# Altium project VCO.PrjPcb
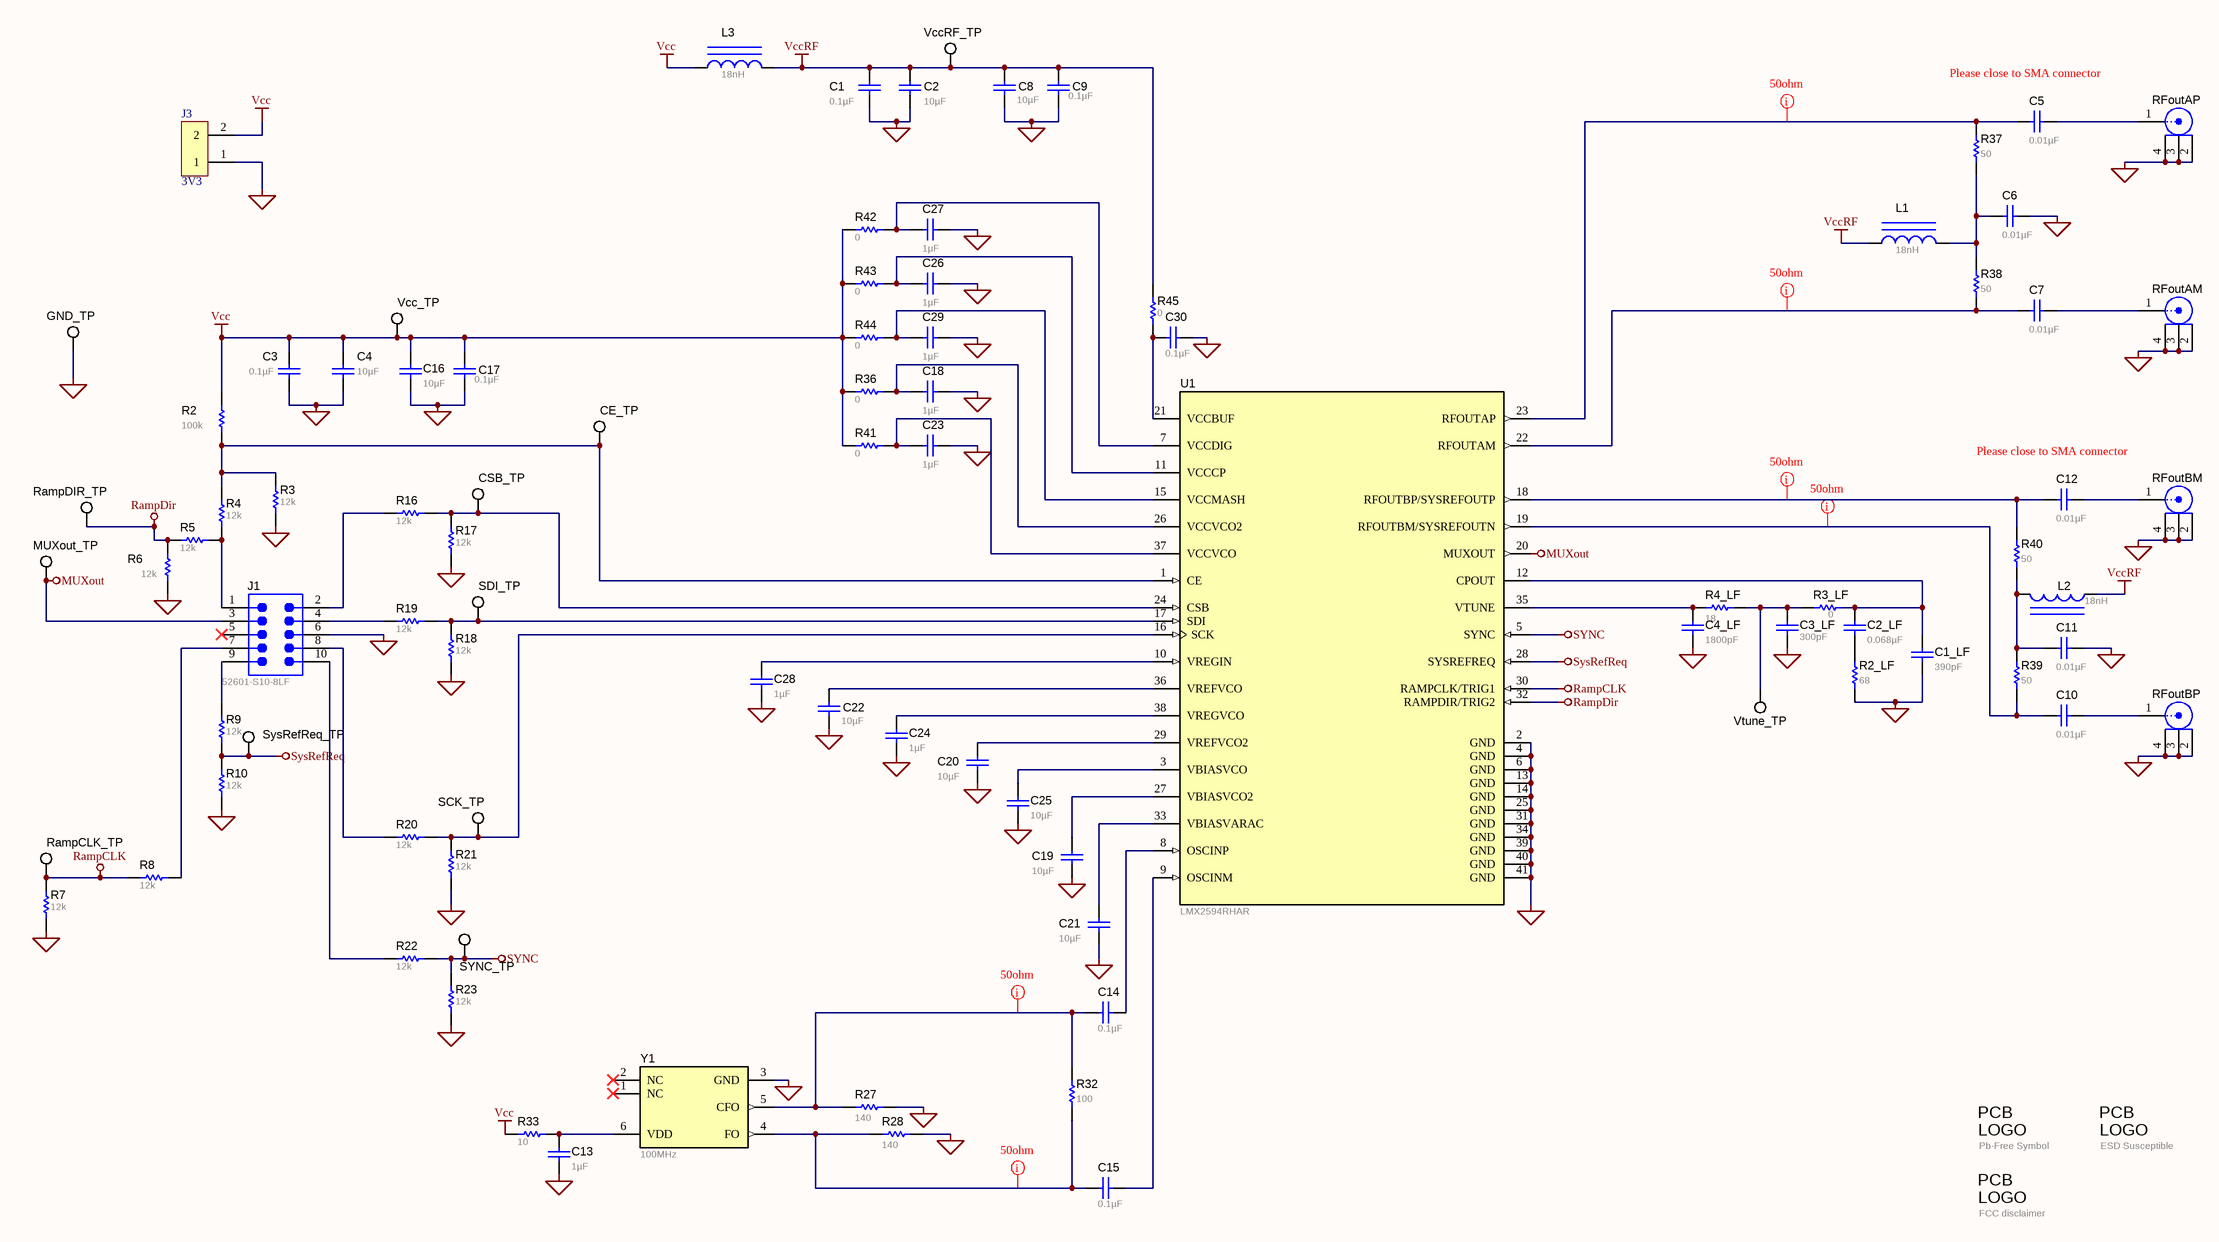
[diagram p0: VCO.SchDoc]
CopyrightYear: 2016; PCB_Layout: Dean Banerjee; PCB_Rev: B; PRJ_Customer: Public Release; PRJ_Engineer: Dean Banerjee; PRJ_Number: SV601308; PRJ_Title: LMX2594EVM; SCH_Rev: B; TechSupport: http://www.ti.com
2 sheets, 123 parts. Net scope: global (net labels, ports and power ports of the same name join across sheets).
Board file: VCO.PcbDoc
Sheets:
  VCO.SchDoc
  PVC.SchDoc

## Sheet VCO.SchDoc: LMX2594SOLDER
size C; Date: Not shown in title block; ApprovedBy: Not shown in title block; CheckedBy: Not shown in title block; Author: Not shown in title block; CompanyName: Not shown in title block; DrawnBy: Not shown in title block; Engineer: Not shown in title block; Organization: Not shown in title block; Address1: Not shown in title block; Address2: Not shown in title block; Address3: Not shown in title block; Address4: Not shown in title block; DocumentNumber: 1; Revision: Use project parameter SCH_Rev; SheetNumber: 1; SheetTotal: 1; PageSetup: Record=PageOptions|CenterHorizontal=True|CenterVertical=True|PrintScale=0.73|XCorrection=1.00|YCorrection=1.00|PrintKind=0|BorderSize=5000000|LeftOffset=0|BottomOffset=0|Orientation=2|PaperLength=1000|PaperWidth=1000|Scale=100|PaperSource=15|PrintQuality=600|MediaType=1|DitherType=10|PrintScaleMode=1|PaperKind=Legal (8.5 x 14")|PaperIndex=5; CurrentTime: Not shown in title block; CurrentDate: Not shown in title block; Time: Not shown in title block; DocumentFullPathAndName: Not shown in title block; DocumentName: Not shown in title block; ModifiedDate: 2/1/2011; ImagePath: Not shown in title block; ProjectName: LMX2594EVM

### Parts
C1  ValueDisplayed: 0.1µF  [0603]  (hidden comment: 0603YC104JAT2A)
C1_LF  ValueDisplayed: 390pF  [0603]  (hidden comment: C0603C391J5GACTU)
C2  ValueDisplayed: 10µF  [0805]  (hidden comment: C0805C106K8PACTU)
C2_LF  ValueDisplayed: 0.068µF  [0603]  (hidden comment: GRM188R71H683KA93D)
C3  ValueDisplayed: 0.1µF  [0603]  (hidden comment: 0603YC104JAT2A)
C3_LF  ValueDisplayed: 300pF  [0603]  (hidden comment: GRM1885C2A301JA01D)
C4  ValueDisplayed: 10µF  [0805]  (hidden comment: C0805C106K8PACTU)
C4_LF  ValueDisplayed: 1800pF  [0603]  (hidden comment: GRM1885C1H182JA01D)
C5  ValueDisplayed: 0.01µF  [0402_065]  (hidden comment: 520L103KT16T)
C6  ValueDisplayed: 0.01µF  [0402_065]  (hidden comment: 520L103KT16T)
C7  ValueDisplayed: 0.01µF  [0402_065]  (hidden comment: 520L103KT16T)
C8  ValueDisplayed: 10µF  [0805]  (hidden comment: C0805C106K8PACTU)
C9  ValueDisplayed: 0.1µF  [0603]  (hidden comment: 0603YC104JAT2A)
C10  ValueDisplayed: 0.01µF  [0402_065]  (hidden comment: 520L103KT16T)
C11  ValueDisplayed: 0.01µF  [0402_065]  (hidden comment: 520L103KT16T)
C12  ValueDisplayed: 0.01µF  [0402_065]  (hidden comment: 520L103KT16T)
C13  ValueDisplayed: 1µF  [0603]  (hidden comment: C1608X7R1C105K080AC)
C14  ValueDisplayed: 0.1µF  [0603L]  (hidden comment: 0603YC104JAT2A)
C15  ValueDisplayed: 0.1µF  [0603L]  (hidden comment: 0603YC104JAT2A)
C16  ValueDisplayed: 10µF  [0805]  (hidden comment: C0805C106K8PACTU)
C17  ValueDisplayed: 0.1µF  [0603]  (hidden comment: 0603YC104JAT2A)
C18  ValueDisplayed: 1µF  [0603]  (hidden comment: C1608X7R1C105K080AC)
C19  ValueDisplayed: 10µF  [0603]  (hidden comment: C1608X5R1A106M080AC)
C20  ValueDisplayed: 10µF  [0603]  (hidden comment: C1608X5R1A106M080AC)
C21  ValueDisplayed: 10µF  [0603]  (hidden comment: C1608X5R1A106M080AC)
C22  ValueDisplayed: 10µF  [0603]  (hidden comment: C1608X5R1A106M080AC)
C23  ValueDisplayed: 1µF  [0603]  (hidden comment: C1608X7R1C105K080AC)
C24  ValueDisplayed: 1µF  [0603]  (hidden comment: C1608X7R1C105K080AC)
C25  ValueDisplayed: 10µF  [0603]  (hidden comment: C1608X5R1A106M080AC)
C26  ValueDisplayed: 1µF  [0603L]  (hidden comment: C1608X7R1C105K080AC)
C27  ValueDisplayed: 1µF  [0603]  (hidden comment: C1608X7R1C105K080AC)
C28  ValueDisplayed: 1µF  [0603]  (hidden comment: C1608X7R1C105K080AC)
C29  ValueDisplayed: 1µF  [0603L]  (hidden comment: C1608X7R1C105K080AC)
C30  ValueDisplayed: 0.1µF  [0603L]  (hidden comment: 0603YC104JAT2A)
CE_TP  5007  [Keystone5007]  (value not drawn)
CSB_TP  5007  [Keystone5007]  (value not drawn)
GND_TP  5007  [Keystone5007]  (value not drawn)
J1  52601-S10-8LF  [FCI_52601-S10-8LF]
J3  3V3  [PHOENIX_1935161]
L1  ValueDisplayed: 18nH  [IND_LQG15H]  (hidden comment: LQG15HS18NJ02D)
L2  ValueDisplayed: 18nH  [IND_LQG15H]  (hidden comment: LQG15HS18NJ02D)
L3  ValueDisplayed: 18nH  [0402L]  (hidden comment: LQG15HS18NJ02D)
Logo1  ESD Susceptible  [ESD_Overlay_Small]  (no BOM)
Logo3  Pb-Free Symbol  [Pb-Free_Overlay_Medium]  (no BOM)
Logo4  FCC disclaimer  [FCC_disclaimer]  (no BOM)
MUXout_TP  5007  [Keystone5007]  (value not drawn)
R2  ValueDisplayed: 100k  [0603]  (hidden comment: CRCW0603100KJNEA)
R2_LF  ValueDisplayed: 68  [0603]  (hidden comment: CRCW060368R0JNEA)
R3  value 12k  [0603]  (hidden comment: CRCW060312K0JNEA)
R3_LF  ValueDisplayed: 0  [0603]  (hidden comment: CRCW06030000Z0EA)
R4  value 12k  [0603]  (hidden comment: CRCW060312K0JNEA)
R4_LF  ValueDisplayed: 18  [0603]  (hidden comment: CRCW060318R0JNEA)
R5  value 12k  [0603]  (hidden comment: CRCW060312K0JNEA)
R6  value 12k  [0603]  (hidden comment: CRCW060312K0JNEA)
R7  value 12k  [0603]  (hidden comment: CRCW060312K0JNEA)
R8  value 12k  [0603]  (hidden comment: CRCW060312K0JNEA)
R9  value 12k  [0603]  (hidden comment: CRCW060312K0JNEA)
R10  value 12k  [0603]  (hidden comment: CRCW060312K0JNEA)
R16  value 12k  [0603]  (hidden comment: CRCW060312K0JNEA)
R17  value 12k  [0603]  (hidden comment: CRCW060312K0JNEA)
R18  value 12k  [0603]  (hidden comment: CRCW060312K0JNEA)
R19  value 12k  [0603]  (hidden comment: CRCW060312K0JNEA)
R20  value 12k  [0603]  (hidden comment: CRCW060312K0JNEA)
R21  value 12k  [0603]  (hidden comment: CRCW060312K0JNEA)
R22  value 12k  [0603]  (hidden comment: CRCW060312K0JNEA)
R23  value 12k  [0603]  (hidden comment: CRCW060312K0JNEA)
R27  ValueDisplayed: 140  [0603]  (hidden comment: CRCW0603140RFKEA)
R28  ValueDisplayed: 140  [0603]  (hidden comment: CRCW0603140RFKEA)
R32  ValueDisplayed: 100  [0603L]  (hidden comment: CRCW0603100RFKEA)
R33  value 10  [0603]  (hidden comment: CRCW060310R0JNEA)
R36  value 0  [0603]  (hidden comment: CRCW06030000Z0EA)
R37  ValueDisplayed: 50  [0402L]  (hidden comment: FC0402E50R0BST1)
R38  ValueDisplayed: 50  [0402L]  (hidden comment: FC0402E50R0BST1)
R39  ValueDisplayed: 50  [0402L]  (hidden comment: FC0402E50R0BST1)
R40  ValueDisplayed: 50  [0402L]  (hidden comment: FC0402E50R0BST1)
R41  value 0  [0603]  (hidden comment: CRCW06030000Z0EA)
R42  value 0  [0603]  (hidden comment: CRCW06030000Z0EA)
R43  value 0  [0603L]  (hidden comment: CRCW06030000Z0EA)
R44  value 0  [0603L]  (hidden comment: CRCW06030000Z0EA)
R45  value 0  [0603L]  (hidden comment: CRCW06030000Z0EA)
RampCLK_TP  5007  [Keystone5007]  (value not drawn)
RampDIR_TP  5007  [Keystone5007]  (value not drawn)
RFoutAM  142-0771-831  [Johnson_142-0771-831]  (value not drawn)
RFoutAP  142-0771-831  [Johnson_142-0771-831]  (value not drawn)
RFoutBM  142-0771-831  [Johnson_142-0771-831]  (value not drawn)
RFoutBP  142-0771-831  [Johnson_142-0771-831]  (value not drawn)
SCK_TP  5007  [Keystone5007]  (value not drawn)
SDI_TP  5007  [Keystone5007]  (value not drawn)
SYNC_TP  5007  [Keystone5007]  (value not drawn)
SysRefReq_TP  5007  [Keystone5007]  (value not drawn)
U1  LMX2594RHAR  [RHA0040A]
Vcc_TP  5007  [Keystone5007]  (value not drawn)
VccRF_TP  5007  [Keystone5007]  (value not drawn)
Vtune_TP  5007  [Keystone5007]  (value not drawn)
Y1  Frequency: 100MHz  [Vectron_VC-708]  (hidden comment: VC-708-EDE-FNXN-100M000000)

### Nets
GND: C1.1 C1_LF.2 C2.1 C3.1 C3_LF.2 C4.1 C4_LF.1 C6.1 C8.1 C9.1 C11.1 C13.2 C16.1 C17.1 C18.1 C19.1 C20.2 C21.1 C22.2 C23.1 C24.1 C25.2 C26.1 C27.1 C28.1 C29.2 C30.1 GND_TP.1 J1.6 J3.1 R2_LF.2 R3.1 R6.1 R7.1 R10.1 R17.1 R18.1 R21.1 R23.1 R27.1 R28.1 RFoutAM.2 RFoutAM.3 RFoutAM.4 RFoutAP.2 RFoutAP.3 RFoutAP.4 RFoutBM.2 RFoutBM.3 RFoutBM.4 RFoutBP.2 RFoutBP.3 RFoutBP.4 U1.2(GND) U1.4(GND) U1.6(GND) U1.13(GND) U1.14(GND) U1.25(GND) U1.31(GND) U1.34(GND) U1.39(GND) U1.40(GND) U1.41(GND) Y1.3(GND)
MUXout: J1.3 MUXout_TP.1 U1.20(MUXOUT)
RampCLK: R7.2 R8.2 RampCLK_TP.1 U1.30(RAMPCLK/TRIG1)
RampDir: R5.1 R6.2 RampDIR_TP.1 U1.32(RAMPDIR/TRIG2)
SYNC: R22.2 R23.2 SYNC_TP.1 U1.5(SYNC)
SysRefReq: R9.2 R10.2 SysRefReq_TP.1 U1.28(SYSREFREQ)
Vcc: C3.2 C4.2 C16.2 C17.2 J3.2 L3.1 R2.1 R33.2 R36.2 R41.2 R42.1 R43.1 R44.1 Vcc_TP.1
VccRF: C1.2 C2.2 C8.2 C9.2 L1.1 L2.1 L3.2 R45.1 VccRF_TP.1
NetC1_LF_1: C1_LF.1 C2_LF.1 R3_LF.1 U1.12(CPOUT)
NetC2_LF_2: C2_LF.2 R2_LF.1
NetC3_LF_1: C3_LF.1 R3_LF.2 R4_LF.2 Vtune_TP.1
NetC4_LF_2: C4_LF.2 R4_LF.1 U1.35(VTUNE)
NetC5_1: C5.1 RFoutAP.1
NetC5_2: C5.2 R37.1 U1.23(RFOUTAP)
NetC6_2: C6.2 L1.2 R37.2 R38.2
NetC7_1: C7.1 RFoutAM.1
NetC7_2: C7.2 R38.1 U1.22(RFOUTAM)
NetC10_1: C10.1 RFoutBP.1
NetC10_2: C10.2 R39.1 U1.19(RFOUTBM/SYSREFOUTN)
NetC11_2: C11.2 L2.2 R39.2 R40.1
NetC12_1: C12.1 RFoutBM.1
NetC12_2: C12.2 R40.2 U1.18(RFOUTBP/SYSREFOUTP)
NetC13_1: C13.1 R33.1 Y1.6(VDD)
NetC14_1: C14.1 R27.2 R32.2 Y1.5(CFO)
NetC14_2: C14.2 U1.8(OSCINP)
NetC15_1: C15.1 R28.2 R32.1 Y1.4(FO)
NetC15_2: C15.2 U1.9(OSCINM)
NetC18_2: C18.2 R36.1 U1.26(VCCVCO2)
NetC19_2: C19.2 U1.27(VBIASVCO2)
NetC20_1: C20.1 U1.29(VREFVCO2)
NetC21_2: C21.2 U1.33(VBIASVARAC)
NetC22_1: C22.1 U1.36(VREFVCO)
NetC23_2: C23.2 R41.1 U1.37(VCCVCO)
NetC24_2: C24.2 U1.38(VREGVCO)
NetC25_1: C25.1 U1.3(VBIASVCO)
NetC26_2: C26.2 R43.2 U1.11(VCCCP)
NetC27_2: C27.2 R42.2 U1.7(VCCDIG)
NetC28_2: C28.2 U1.10(VREGIN)
NetC29_1: C29.1 R44.2 U1.15(VCCMASH)
NetC30_2: C30.2 R45.2 U1.21(VCCBUF)
NetCE_TP_1: CE_TP.1 R2.2 R3.2 R4.2 U1.1(CE)
NetCSB_TP_1: CSB_TP.1 R16.2 R17.2 U1.24(CSB)
NetJ1_1: J1.1 R4.1 R5.2
NetJ1_2: J1.2 R16.1
NetJ1_4: J1.4 R19.2
NetJ1_7: J1.7 R8.1
NetJ1_8: J1.8 R20.1
NetJ1_9: J1.9 R9.1
NetJ1_10: J1.10 R22.1
NetR18_2: R18.2 R19.1 SDI_TP.1 U1.17(SDI)
NetR20_2: R20.2 R21.2 SCK_TP.1 U1.16(SCK)

Not connected (* = marked no-connect by the designer): J1 5*; Y1 1(NC)* 2(NC)*

### Layout directives
mark named 50ohm: NetC5_2, NetC7_2, NetC10_2, NetC12_2, NetC14_1, NetC15_1

### Notes on the sheet
- Please close to SMA connector
- Title
- Size:
- Date:
- File:
- C
- Number:
- Time:
- Revision:
- Sheet
- of
- (in symbol ESD_Susceptible) PCB; LOGO
- (in symbol FCC_disclaimer) PCB; LOGO
- (in symbol Pb-Free) PCB; LOGO

### Library data of the parts
C1 C3 C9 C17 = 0603YC104JAT2A: CAP, CERM, 0.1uF, 16V, +/-5%, X7R, 0603; Manufacturer: AVX; ESR_Ohm: 0.039; Polarized: N; TaMax_C: 125; TaMin_C: -55; Tolerance_%: 5; VDC_V: 16; Cap_F: 0.0000001; CompType: Capacitor; Value1: 0.039 ohm; U/M: EA; Cap_Case: 0603; MountType: SMT; Technology: Ceramic; PartNumber: 0603YC104JAT2A; SymbolVersion: 2008-07-09; RoHS: Y; Dielectric: X7R; Value: 0.1uF; DigiKeyPartNumber: 478-3726-1-ND; PackageReference: 0603; Value2: 16V; Published: 2008-06-19; Publisher: National Semiconductor; LatestRevisionDate: 2011-06-13; LatestRevisionNote: Added Alternate PartNumber and Alternate Manufacturer parameters.; ComponentLink1Description: Datasheet link; ComponentLink1URL: http://www.avx.com/docs/masterpubs/smccp.pdf; Alternate PartNumber: -; Alternate Manufacturer: -
C1_LF = C0603C391J5GACTU: CAP, CERM, 390 pF, 50 V, +/- 5%, C0G/NP0, 0603; Manufacturer: Kemet; Polarized: N; TaMax_C: 125; TaMin_C: -55; Tolerance_%: 5; VDC_V: 50; Cap_F: 0.00000000039; CompType: Capacitor; Value: 390pF; Value1: Unknown; Value2: 50V; U/M: EA; AEC Category: Q200; SizeArea_mm2: 1.28; SizeAreaWB_mm2: 4.68; SizeX_mm: 1.6; SizeY_mm: 0.8; SizeZ_mm: 1; Cap_Case: 0603; MountType: SMT; Technology: Ceramic; PartNumber: C0603C391J5GACTU; SymbolVersion: 2008-07-09; RoHS: Y; PackageReference: 0603; Published: 2008-06-19; Publisher: Texas Instruments; LatestRevisionDate: 2016-11-28; ComponentLink1Description: Datasheet link; ComponentLink1URL: http://www.kemet.com/kemet/web/homepage/kechome.nsf/vapubfiles/F3102_Y5V.pdf/$file/F3102_Y5V.pdf; TempCo: C0G/NP0; Supplier 1: Digi-Key; Supplier Part Number 1: 399-1069-1-ND; Supplier 2: Mouser; Supplier Part Number 2: 80-C0603C391J5G; Supplier 3: Farnell; Supplier Part Number 3: 1414638; AEC Qualified: ?
C2 C4 C8 C16 = C0805C106K8PACTU: CAP, CERM, 10uF, 10V, +/-10%, X5R, 0805; Manufacturer: Kemet; ESR_Ohm: 0.003; IRMS_A: 11.43; Polarized: N; TaMax_C: 85; TaMin_C: -55; Tolerance_%: 10; Cap_F: 0.00001; CompType: Capacitor; U/M: EA; Value1: 0.003 ohm; Cap_Case: 0805; MountType: SMT; Technology: Ceramic; VDC_V: 10; PartNumber: C0805C106K8PACTU; SymbolVersion: 2008-07-09; RoHS: Y; Dielectric: X5R; Value: 10uF; DigiKeyPartNumber: 399-4925-1-ND; PackageReference: 0805; Value2: 10V; Published: 2008-06-19; Publisher: National Semiconductor; LatestRevisionDate: 2011-03-11; LatestRevisionNote: Added Alternate PartNumber and Alternate Manufacturer parameters.; ComponentLink1Description: Datasheet link; ComponentLink1URL: http://www.kemet.com/kemet/web/homepage/kechome.nsf/file/Partial%20Copy%20-%20Ceramic%20Surface%20Mount%20Capacitors/$file/F3102_CE.pdf; Supplier 1: Newark; Supplier Part Number 1: 70K9138; Alternate PartNumber: -; Alternate Manufacturer: -
C2_LF = GRM188R71H683KA93D: CAP, CERM, 0.068 µF, 50 V, +/- 10%, X7R, 0603; Manufacturer: MuRata; Polarized: N; TaMax_C: 125; TaMin_C: -55; Tolerance_%: 10; VDC_V: 50; Cap_F: 0.000000068; CompType: Capacitor; Value: 0.068uF; Value1: Unknown; Value2: 50V; U/M: EA; AEC Category: Q200; SizeArea_mm2: 1.28; SizeAreaWB_mm2: 4.68; SizeX_mm: 1.6; SizeY_mm: 0.8; SizeZ_mm: 1; Cap_Case: 0603; MountType: SMT; Technology: Ceramic; PartNumber: GRM188R71H683KA93D; SymbolVersion: 2008-07-09; RoHS: Y; PackageReference: 0603; Published: 2008-06-19; Publisher: Texas Instruments; LatestRevisionDate: 2016-11-28; ComponentLink1Description: Datasheet link; ComponentLink1URL: http://search.murata.co.jp/Ceramy/PnsearchViewAction.do?HnOFG=ON&HnNFG=ON&SEL_CNT=50&sLang=en&sKey=GRM188R71H683KA93D&x=9&y=9&search=startwith; TempCo: X7R; Supplier 1: Digi-Key; Supplier Part Number 1: 490-3288-1-ND; Supplier 2: Mouser; Supplier Part Number 2: 81-GRM188R71H683KA93; Supplier 3: Farnell; Supplier Part Number 3: 1403793; AEC Qualified: ?
C3_LF = GRM1885C2A301JA01D: CAP, CERM, 300pF, 100V, +/-5%, C0G/NP0, 0603; Manufacturer: MuRata; Polarized: N; TaMax_C: 125; TaMin_C: -55; Tolerance_%: 5; VDC_V: 100; Cap_F: 0.0000000003; CompType: Capacitor; Value1: Unknown; U/M: EA; Cap_Case: 0603; MountType: SMT; Technology: Ceramic; PartNumber: GRM1885C2A301JA01D; SymbolVersion: 2008-07-09; RoHS: Y; Value: 300pF; PackageReference: 0603; Value2: 100V; Published: 2008-06-19; Publisher: Texas Instruments; LatestRevisionDate: 2014-03-28; ComponentLink1Description: Datasheet link; ComponentLink1URL: http://search.murata.co.jp/Ceramy/PnsearchViewAction.do?HnOFG=ON&HnNFG=ON&SEL_CNT=50&sLang=en&sKey=GRM1885C2A301JA01D&x=9&y=9&search=startwith; TempCo: C0G/NP0; Supplier 1: Digi-Key; Supplier Part Number 1: 490-1362-1-ND; Supplier 2: Mouser; Supplier Part Number 2: 81-GRM1885C2A301JA1D
C4_LF = GRM1885C1H182JA01D: CAP, CERM, 1800 pF, 50 V, +/- 5%, C0G/NP0, 0603; Manufacturer: MuRata; Polarized: N; TaMax_C: 125; TaMin_C: -55; Tolerance_%: 5; VDC_V: 50; Cap_F: 0.0000000018; CompType: Capacitor; Value: 1800pF; Value1: Unknown; Value2: 50V; U/M: EA; SizeArea_mm2: 1.28; SizeAreaWB_mm2: 4.68; SizeX_mm: 1.6; SizeY_mm: 0.8; SizeZ_mm: 1; AEC Category: Q200; Cap_Case: 0603; MountType: SMT; Technology: Ceramic; PartNumber: GRM1885C1H182JA01D; SymbolVersion: 2008-07-09; RoHS: Y; PackageReference: 0603; Published: 2008-06-19; Publisher: Texas Instruments; LatestRevisionDate: 2016-11-28; ComponentLink1Description: Datasheet link; ComponentLink1URL: http://search.murata.co.jp/Ceramy/PnsearchViewAction.do?HnOFG=ON&HnNFG=ON&SEL_CNT=50&sLang=en&sKey=GRM1885C1H182JA01D&x=9&y=9&search=startwith; TempCo: C0G/NP0; Supplier 1: Digi-Key; Supplier Part Number 1: 490-1457-1-ND; Supplier 2: Mouser; Supplier Part Number 2: 81-GRM1885C1H182JA01; AEC Qualified: ?
C5-C7 C10-C12 = 520L103KT16T: CAP, CERM, 0.01 µF, 16 V, +/- 10%, X7R, 0402; Manufacturer: AT Ceramics; Polarized: N; CompType: Capacitor; Value: 0.01uF; U/M: EA; Cap_F: 0.00000001; Tolerance_%: 10; Value1: Unknown; VDC_V: 16; Value2: 16V; TaMin_C: -55; TaMax_C: 125; Cap_Case: 0402; AEC Category: Q200; SizeArea_mm2: 0.5; SizeAreaWB_mm2: 3; SizeX_mm: 1; SizeZ_mm: 0.65; SymbolVersion: 2008-07-09; PartNumber: 520L103KT16T; PackageReference: 0402; RoHS: Y; MountType: SMT; Technology: Ceramic; TempCo: X7R; Published: 2008-06-19; Publisher: Texas Instruments; LatestRevisionDate: 2016-06-23; ComponentLink1Description: Datasheet link; ComponentLink1URL: https://www.atceramics.com/UserFiles/520l.pdf; Supplier 1: Digi-Key; Supplier Part Number 1: 1284-1540-1-ND; Supplier 2: Mouser; Supplier Part Number 2: 581-520L103KT16T; AEC Qualified: N; AEC Grade: N/A; SizeY_mm: 0.5
C13 C24 = C1608X7R1C105K080AC: CAP, CERM, 1 µF, 16 V, +/- 10%, X7R, 0603; Manufacturer: TDK; ESR_ohm: 0.0057; Polarized: N; TaMax_C: 125; TaMin_C: -55; Tolerance_%: 10; VDC_V: 16; Cap_F: 0.000001; CompType: Capacitor; Value: 1uF; U/M: EA; Value1: 0.0057 ohm; Value2: 16V; AEC Category: Q200; Cap_Case: 0603; MountType: SMT; Technology: Ceramic; PartNumber: C1608X7R1C105K080AC; SymbolVersion: 2008-07-09; RoHS: Y; PackageReference: 0603; ComponentLink1Description: Datasheet link; ComponentLink1URL: http://www.tdk.co.jp/tefe02/e412_c.pdf; Publisher: Texas Instruments; LatestRevisionDate: 2016-03-08; Published: 2008-06-19; TempCo: X7R; Supplier 1: Digi-Key; Supplier Part Number 1: 445-1604-1-ND; Supplier 2: Mouser; Supplier Part Number 2: 810-C1608X7R1C105K; Supplier 3: Farnell; Supplier Part Number 3: 1907343; AEC Qualified: ?
C14 C15 C30 = 0603YC104JAT2A: CAP, CERM, 0.1uF, 16V, +/-5%, X7R, 0603; Manufacturer: AVX; Cap_Case: 0603; ESR_Ohm: 0.039; Polarized: N; TaMax_C: 125; TaMin_C: -55; Tolerance_%: 5; VDC_V: 16; Cap_F: 0.0000001; CompType: Capacitor; Value1: 0.039 ohm; U/M: EA; MountType: SMT; Technology: Ceramic; PartNumber: 0603YC104JAT2A; SymbolVersion: 2008-07-09; RoHS: Y; Dielectric: X7R; Value: 0.1uF; DigiKeyPartNumber: 478-3726-1-ND; PackageReference: 0603; Value2: 16V; Published: 2008-06-19; Publisher: National Semiconductor; LatestRevisionDate: 2011-06-13; LatestRevisionNote: Added Alternate PartNumber and Alternate Manufacturer parameters.; ComponentLink1Description: Datasheet link; ComponentLink1URL: http://www.avx.com/docs/masterpubs/smccp.pdf; Alternate PartNumber: -; Alternate Manufacturer: -
C18 C23 C27 = C1608X7R1C105K080AC: CAP, CERM, 1 µF, 16 V, +/- 10%, X7R, 0603; Manufacturer: TDK; ESR_ohm: 0.0057; Polarized: N; TaMax_C: 125; TaMin_C: -55; Tolerance_%: 10; VDC_V: 16; Cap_F: 0.000001; CompType: Capacitor; Value: 1uF; Value1: 0.0057 ohm; Value2: 16V; U/M: EA; SizeArea_mm2: 1.28; SizeAreaWB_mm2: 4.68; SizeX_mm: 1.6; SizeY_mm: 0.8; SizeZ_mm: 1; AEC Category: Q200; Cap_Case: 0603; MountType: SMT; Technology: Ceramic; PartNumber: C1608X7R1C105K080AC; SymbolVersion: 2008-07-09; RoHS: Y; PackageReference: 0603; Published: 2008-06-19; Publisher: Texas Instruments; LatestRevisionDate: 2016-06-30; ComponentLink1Description: Datasheet link; ComponentLink1URL: http://www.tdk.co.jp/tefe02/e412_c.pdf; TempCo: X7R; Supplier 1: Digi-Key; Supplier Part Number 1: 445-1604-1-ND; Supplier 2: Mouser; Supplier Part Number 2: 810-C1608X7R1C105K; Supplier 3: Farnell; Supplier Part Number 3: 1907343; AEC Qualified: ?
C19-C22 C25 = C1608X5R1A106M080AC: CAP, CERM, 10 µF, 10 V, +/- 20%, X5R, 0603; Manufacturer: TDK; ESR_ohm: 0.0078; IRMS_A: 1.85; Polarized: N; TaMax_C: 85; TaMin_C: -55; Tolerance_%: 20; VDC_V: 10; Cap_F: 0.00001; CompType: Capacitor; Value: 10uF; U/M: EA; Value1: 0.0078 ohm; Value2: 10V; AEC Category: Q200; Cap_Case: 0603; MountType: SMT; Technology: Ceramic; PartNumber: C1608X5R1A106M080AC; SymbolVersion: 2008-07-09; RoHS: Y; PackageReference: 0603; Published: 2008-06-19; Publisher: Texas Instruments; LatestRevisionDate: 2016-03-08; ComponentLink1Description: Datasheet link; ComponentLink1URL: http://www.tdk.com/pdf/general_B11.pdf; TempCo: X5R; Supplier 1: Digi-Key; Supplier Part Number 1: 445-6853-1-ND; Supplier 2: Mouser; Supplier Part Number 2: 810-C1608X5R1A106M; Supplier 3: Farnell; Supplier Part Number 3: 1962113; AEC Qualified: ?
C26 C29 = C1608X7R1C105K080AC: CAP, CERM, 1 µF, 16 V, +/- 10%, X7R, 0603; Manufacturer: TDK; Cap_Case: 0603; ESR_ohm: 0.0057; Polarized: N; TaMax_C: 125; TaMin_C: -55; Tolerance_%: 10; VDC_V: 16; Cap_F: 0.000001; CompType: Capacitor; Value: 1uF; Value1: 0.0057 ohm; Value2: 16V; U/M: EA; SizeArea_mm2: 1.28; SizeAreaWB_mm2: 4.68; SizeX_mm: 1.6; SizeY_mm: 0.8; SizeZ_mm: 1; AEC Category: Q200; MountType: SMT; Technology: Ceramic; PartNumber: C1608X7R1C105K080AC; SymbolVersion: 2008-07-09; RoHS: Y; PackageReference: 0603; Published: 2008-06-19; Publisher: Texas Instruments; LatestRevisionDate: 2016-06-30; ComponentLink1Description: Datasheet link; ComponentLink1URL: http://www.tdk.co.jp/tefe02/e412_c.pdf; TempCo: X7R; Supplier 1: Digi-Key; Supplier Part Number 1: 445-1604-1-ND; Supplier 2: Mouser; Supplier Part Number 2: 810-C1608X7R1C105K; Supplier 3: Farnell; Supplier Part Number 3: 1907343; AEC Qualified: ?
C28 = C1608X7R1C105K080AC: CAP, CERM, 1 µF, 16 V, +/- 10%, X7R, 0603; Manufacturer: TDK; Polarized: N; CompType: Capacitor; Value: 1uF; U/M: EA; Cap_F: 0.000001; Tolerance_%: 10; ESR_ohm: 0.0057; Value1: 0.0057 ohm; VDC_V: 16; Value2: 16V; TaMin_C: -55; TaMax_C: 125; AEC Category: Q200; SymbolVersion: 2008-07-09; PartNumber: C1608X7R1C105K080AC; PackageReference: 0603; RoHS: Y; MountType: SMT; Technology: Ceramic; TempCo: X7R; Cap_Case: 0603; Published: 2008-06-19; Publisher: Texas Instruments; LatestRevisionDate: 2016-03-08; ComponentLink1Description: Datasheet link; ComponentLink1URL: http://www.tdk.co.jp/tefe02/e412_c.pdf; Supplier 1: Digi-Key; Supplier Part Number 1: 445-1604-1-ND; Supplier 2: Mouser; Supplier Part Number 2: 810-C1608X7R1C105K; Supplier 3: Farnell; Supplier Part Number 3: 1907343; AEC Qualified: ?
CE_TP CSB_TP GND_TP MUXout_TP RampCLK_TP RampDIR_TP SCK_TP SDI_TP SYNC_TP SysRefReq_TP Vcc_TP VccRF_TP Vtune_TP = 5007: Test Point, Compact, White, TH; Manufacturer: Keystone; CompType: Test Point Loop; U/M: EA; SymbolVersion: 2008-04-04; PartNumber: 5007; Value: White; RoHS: Y; PackageReference: White Compact Testpoint; MountType: TH; ComponentLink1Description: Datasheet Link; ComponentLink1URL: http://www.keyelco.com/userAssets/file/M60-2p60.pdf; Publisher: Texas Instruments; LatestRevisionDate: 2013-07-19; Supplier 1: Digi-Key; Supplier Part Number 1: 5007K-ND
J1 = 52601-S10-8LF: Header (shrouded), 100mil, 5x2, Gold plated, SMD; Manufacturer: FCI; SymbolCreator: a0412235; U/M: EA; CompType: Header; PartNumber: 52601-S10-8LF; SymbolVersion: 2013-03-14; ClassName: Header; RoHS: Y; PackageReference: SMT Header; MountType: SMT; ComponentLink1Description: Datasheet Link; ComponentLink1URL: http://portal.fciconnect.com/Comergent//fci/drawing/52601.pdf; Publisher: Texas Instruments; LatestRevisionDate: 2013-07-19; Supplier 1: Digi-Key; Supplier Part Number 1: 609-3593-ND; Supplier 2: Mouser; Supplier Part Number 2: 649-52601-S10-8LF
J3 = 1935161: 2 Position Wire to Board Terminal Block Horizontal with Board 0.197 _5.00mm_ Through Hole; MF: Phoenix Contact; SnapEDA_Link: https://www.snapeda.com/parts/1935161/Phoenix%20Contact/view-part/423515/?ref=snap; MP: 1935161; Value: *; Digi-Key_Purchase_URL: https://www.digikey.ca/product-detail/en/phoenix-contact/1935161/277-1667-ND/568614?utm_source=snapeda&utm_medium=aggregator&utm_campaign=symbol; Digi-Key_Part_Number: 277-1667-ND; Package: None
L1-L3 = LQG15HS18NJ02D: Inductor, Multilayer, Air Core, 18 nH, 0.3 A, 0.36 ohm, SMD; Manufacturer: MuRata; Value: 18nH; Ind_H: 18.0E-9; Imax_A: 0.3; Irms: 0.3A @ C rise; Isat: 0.3A @ % inductance drop; DCR_ohm: 0.36; Value2: 0.3A; AEC Category: Q200; SymbolVersion: 2008-07-23; CompType: Inductor; PartNumber: LQG15HS18NJ02D; Value1: 0.36 ohm; Technology: Multilayer; MountType: SMT; Material: Air Core; PackageReference: 0402 polarized; Published: 2008-06-26; Publisher: Texas Instruments; LatestRevisionDate: 2016-05-27; ComponentLink1Description: Datasheet link; ComponentLink1URL: http://search.murata.co.jp/Ceramy/image/img/PDF/ENG/L0075S0083LQG15HS.pdf; RoHS: Y; Supplier 1: Digi-Key; Supplier Part Number 1: 490-2626-1-ND; Supplier 2: Mouser; Supplier Part Number 2: 81-LQG15HS18NJ02D; Supplier 3: Farnell; Supplier Part Number 3: 1404293; AEC Qualified: ?
Logo1 = ESD_Susceptible: ESD Susceptible Symbol; SymbolCreator: codlsc; SymbolVersion: 2011-08-22; Published: 2009-03-03; Publisher: National Semiconductor; LatestRevisionDate: 2011-10-25; LatestRevisionNote: Added ClassName of Logo.
Logo3 = Pb-Free: SymbolCreator: a0412235; SymbolVersion: 2011-08-22; Published: 2009-03-03; Publisher: Texas Instruments; LatestRevisionDate: 2014-11-20
Logo4 = FCC_disclaimer: SymbolCreator: codlsc; SymbolVersion: 2011-08-22; Published: 2009-03-03; Publisher: Texas Instruments; LatestRevisionDate: 2014-11-20
R2 = CRCW0603100KJNEA: RES, 100 k, 5%, 0.1 W, 0603; Manufacturer: Vishay-Dale; CompType: Resistor; Tolerance_%: 5; VDC_V: 75; Power_W: 0.1; Res_ohm: 100000; Value: 100k; U/M: EA; Value2: 0.1W; EIA_Code: E24; TempCo: 200 ppm/C; SizeArea_mm2: 1.28; SizeX_mm: 1.6; SizeY_mm: 0.8; SizeZ_mm: 1; AEC Category: Q200; PartNumber: CRCW0603100KJNEA; SymbolVersion: 2009-05-29; Technology: Thick Film; MountType: SMT; RoHS: Y; PackageReference: 0603; ComponentLink1Description: Datasheet link; ComponentLink1URL: http://www.vishay.com/docs/20035/dcrcwe3.pdf; Publisher: Texas Instruments; LatestRevisionDate: 2016-06-02; Value_Code: 100k; Value1: 5%; Published: 2008-06-26; Supplier 1: Digi-Key; Supplier Part Number 1: 541-100KGCT-ND; Supplier 2: Mouser; Supplier Part Number 2: 71-CRCW0603J-100K-E3; Supplier 3: Farnell; Supplier Part Number 3: 1692517; AEC Qualified: ?
R2_LF = CRCW060368R0JNEA: RES, 68, 5%, 0.1 W, 0603; Manufacturer: Vishay-Dale; CompType: Resistor; Tolerance_%: 5; VDC_V: 75; Power_W: 0.1; Value: 68; U/M: EA; Value_Code: 68R0; Value2: 0.1W; TempCo: 200 ppm/C; EIA_Code: E24; SizeArea_mm2: 1.28; SizeX_mm: 1.6; SizeY_mm: 0.8; SizeZ_mm: 1; AEC Category: Q200; PartNumber: CRCW060368R0JNEA; SymbolVersion: 2009-05-29; Res_ohm: 68; Technology: Thick Film; MountType: SMT; RoHS: Y; PackageReference: 0603; ComponentLink1Description: Datasheet link; ComponentLink1URL: http://www.vishay.com/docs/20035/dcrcwe3.pdf; Publisher: Texas Instruments; LatestRevisionDate: 2016-11-02; Value1: 5%; Published: 2008-06-26; Supplier 1: Digi-Key; Supplier Part Number 1: 541-68GCT-ND; Supplier 2: Mouser; Supplier Part Number 2: 71-CRCW0603J-68-E3; Supplier 3: Farnell; Supplier Part Number 3: 1514786; AEC Qualified: ?
R3-R10 R16-R23 = CRCW060312K0JNEA: RES, 12k ohm, 5%, 0.1W, 0603; Manufacturer: Vishay-Dale; CompType: Resistor; Tolerance_%: 5; VDC_V: 75; Power_W: 0.1; Res_ohm: 12000; U/M: EA; Value_Code: 12k0; EIA_Code: E24; PartNumber: CRCW060312K0JNEA; SymbolVersion: 2009-05-29; Technology: Thick Film; MountType: SMT; RoHS: Y; PackageReference: 0603; ComponentLink1Description: Datasheet link; ComponentLink1URL: http://www.vishay.com/docs/20035/dcrcwe3.pdf; Publisher: National Semiconductor; LatestRevisionDate: 2010-09-01; LatestRevisionNote: Enhanced Description field.; Value1: 5%; Value2: 0.1W; Published: 2008-06-26; Supplier 1: Newark; Supplier Part Number 1: 72M6821
R3_LF = CRCW06030000Z0EA: RES, 0, 5%, 0.1 W, 0603; Manufacturer: Vishay-Dale; CompType: Resistor; Tolerance_%: 5; VDC_V: 75; Power_W: 0.1; Value: 0; U/M: EA; Value_Code: 0000; Value2: 0.1W; EIA_Code: E24; TempCo: 200 ppm/C; SizeArea_mm2: 1.28; SizeX_mm: 1.6; SizeY_mm: 0.8; SizeZ_mm: 1; AEC Category: Q200; PartNumber: CRCW06030000Z0EA; SymbolVersion: 2009-05-29; Res_ohm: 0; Technology: Thick Film; MountType: SMT; RoHS: Y; PackageReference: 0603; ComponentLink1Description: Datasheet link; ComponentLink1URL: http://www.vishay.com/docs/20035/dcrcwe3.pdf; Publisher: Texas Instruments; LatestRevisionDate: 2016-11-02; Value1: 5%; Published: 2008-06-26; Supplier 1: Digi-Key; Supplier Part Number 1: 541-0.0GCT-ND; Supplier 2: Mouser; Supplier Part Number 2: 71-CRCW0603-0-E3; Supplier 3: Farnell; Supplier Part Number 3: 1469739; AEC Qualified: ?
R4_LF = CRCW060318R0JNEA: RES, 18, 5%, 0.1 W, 0603; Manufacturer: Vishay-Dale; CompType: Resistor; Tolerance_%: 5; VDC_V: 75; Power_W: 0.1; Value: 18; U/M: EA; Value_Code: 18R0; Value2: 0.1W; EIA_Code: E24; TempCo: 200 ppm/C; SizeArea_mm2: 1.28; SizeX_mm: 1.6; SizeY_mm: 0.8; SizeZ_mm: 1; AEC Category: Q200; PartNumber: CRCW060318R0JNEA; SymbolVersion: 2009-05-29; Res_ohm: 18; Technology: Thick Film; MountType: SMT; RoHS: Y; PackageReference: 0603; ComponentLink1Description: Datasheet link; ComponentLink1URL: http://www.vishay.com/docs/20035/dcrcwe3.pdf; Publisher: Texas Instruments; LatestRevisionDate: 2016-11-02; Value1: 5%; Published: 2008-06-26; Supplier 1: Digi-Key; Supplier Part Number 1: 541-18GCT-ND; Supplier 2: Mouser; Supplier Part Number 2: 71-CRCW0603J-18-E3; Supplier 3: Farnell; Supplier Part Number 3: 1514724; AEC Qualified: ?
R27 R28 = CRCW0603140RFKEA: RES, 140, 1%, 0.1 W, 0603; Manufacturer: Vishay-Dale; CompType: Resistor; Tolerance_%: 1; VDC_V: 75; Power_W: 0.1; Value: 140; U/M: EA; Value_Code: 140R; Value2: 0.1W; EIA_Code: E96; TempCo: 100 ppm/C; SizeArea_mm2: 1.28; SizeX_mm: 1.6; SizeY_mm: 0.8; AEC Category: Q200; PartNumber: CRCW0603140RFKEA; SymbolVersion: 2009-05-29; Res_ohm: 140; Technology: Thick Film; MountType: SMT; RoHS: Y; PackageReference: 0603; ComponentLink1Description: Datasheet link; ComponentLink1URL: http://www.vishay.com/docs/20035/dcrcwe3.pdf; Publisher: Texas Instruments; LatestRevisionDate: 2016-11-02; Value1: 1%; Published: 2008-06-26; Supplier 1: Digi-Key; Supplier Part Number 1: 541-140HCT-ND; SizeZ_mm: 1; Supplier 2: Mouser; Supplier Part Number 2: 71-CRCW0603-140-E3; Supplier 3: Farnell; Supplier Part Number 3: 1151701; AEC Qualified: ?
R32 = CRCW0603100RFKEA: RES, 100, 1%, 0.1 W, 0603; Manufacturer: Vishay-Dale; CompType: Resistor; Tolerance_%: 1; VDC_V: 75; Power_W: 0.1; Value: 100; U/M: EA; Value_Code: 100R; Value2: 0.1W; EIA_Code: E96; TempCo: 100 ppm/C; SizeArea_mm2: 1.28; SizeX_mm: 1.6; SizeY_mm: 0.8; AEC Category: Q200; PartNumber: CRCW0603100RFKEA; SymbolVersion: 2009-05-29; Res_ohm: 100; Technology: Thick Film; MountType: SMT; RoHS: Y; PackageReference: 0603; ComponentLink1Description: Datasheet link; ComponentLink1URL: http://www.vishay.com/docs/20035/dcrcwe3.pdf; Publisher: Texas Instruments; LatestRevisionDate: 2016-11-02; Value1: 1%; Published: 2008-06-26; Supplier 1: Digi-Key; Supplier Part Number 1: 541-100HCT-ND; SizeZ_mm: 1; Supplier 2: Mouser; Supplier Part Number 2: 71-CRCW0603-100-E3; Supplier 3: Farnell; Supplier Part Number 3: 1469752; AEC Qualified: ?
R33 = CRCW060310R0JNEA: RES, 10 ohm, 5%, 0.1W, 0603; Manufacturer: Vishay-Dale; CompType: Resistor; Value_Code: 10R0; Tolerance_%: 5; Power_W: 0.1; VDC_V: 75; TempCo: 200 ppm/C; EIA_Code: E24; U/M: EA; SymbolVersion: 2009-05-29; PartNumber: CRCW060310R0JNEA; PackageReference: 0603; RoHS: Y; Res_ohm: 10; Value1: 5%; Value2: 0.1W; MountType: SMT; Technology: Thick Film; Published: 2008-06-26; Publisher: Texas Instruments; LatestRevisionDate: 2013-01-08; ComponentLink1Description: Datasheet link; ComponentLink1URL: http://www.vishay.com/docs/20035/dcrcwe3.pdf; Supplier 1: Digi-Key; Supplier Part Number 1: 541-10GCT-ND; Supplier 2: Mouser; Supplier Part Number 2: 71-CRCW0603J-10-E3; Supplier 3: Farnell; Supplier Part Number 3: 1514712
R36 R41-R45 = CRCW06030000Z0EA: RES, 0 ohm, 5%, 0.1W, 0603; Manufacturer: Vishay-Dale; CompType: Resistor; Tolerance_%: 5; VDC_V: 75; Power_W: 0.1; U/M: EA; Value_Code: 0000; EIA_Code: E24; PartNumber: CRCW06030000Z0EA; SymbolVersion: 2009-05-29; Res_ohm: 0; Technology: Thick Film; MountType: SMT; RoHS: Y; PackageReference: 0603; ComponentLink1Description: Datasheet link; ComponentLink1URL: http://www.vishay.com/docs/20035/dcrcwe3.pdf; Publisher: National Semiconductor; LatestRevisionDate: 2010-09-01; LatestRevisionNote: Enhanced Description field.; Value1: 5%; Value2: 0.1W; Published: 2008-06-26; Supplier 1: Newark; Supplier Part Number 1: 52K8014; DigiKeyPartNumber: 541-0.0GCT-ND
R37-R40 = FC0402E50R0BST1: RES, 50, 0.1%, 0.05 W, 0402; Manufacturer: Vishay-Dale; CompType: Resistor; Value: 50; Value_Code: 50R0; Tolerance_%: 0.1; Power_W: 0.05; Value2: 0.05W; TempCo: 25 ppm/C; U/M: EA; SizeArea_mm2: 0.5; SizeX_mm: 1; SizeZ_mm: 0.6; AEC Category: Q200; AEC Qualified: N; SymbolVersion: 2009-05-29; PartNumber: FC0402E50R0BST1; PackageReference: 0402; RoHS: Y; Res_ohm: 50; Value1: 0.1%; MountType: SMT; Technology: Thin Film; Published: 2008-06-26; Publisher: Texas Instruments; LatestRevisionDate: 2016-06-23; ComponentLink1Description: Datasheet link; ComponentLink1URL: http://www.vishay.com/docs/60093/fcseries.pdf; Supplier 1: Digi-Key; Supplier Part Number 1: FC0402-50BWCT-ND; Supplier 2: Mouser; Supplier Part Number 2: 71-FC0402E50R0BST1; Supplier 3: Farnell; Supplier Part Number 3: 2309101; SizeY_mm: 0.5; AEC Grade: N/A
RFoutAM RFoutAP RFoutBM RFoutBP = 142-0771-831: JACK, SMA, 50 Ohm, Gold, Edge Mount; Manufacturer: Johnson; SymbolCreator: Altium; Gender: Female; Voltage_V: 170; SymbolVersion: 2016-06-06; PartNumber: 142-0771-831; PackageReference: JACK, SMA, 50 Ohm, Gold, Edge Mount; CompType: Jack; RoHS: Y; MountType: SMT; ComponentLink1Description: Datasheet URL; ComponentLink1URL: https://cinchconnectivity.com/OA_MEDIA/drawings/dr-142-0771-831.pdf; Orientation: R/A; ContactFinish: Gold; Color: Gold; Publisher: Texas Instruments; LatestRevisionDate: 2016-11-22; Supplier 1: Digi-Key; Supplier Part Number 1: J808-ND; Supplier 2: Mouser; Supplier Part Number 2: 530-142-0771-831
U1 = LMX2594RHAR: High Performance, Wideband PLLatinum RF Synthesizer, RHA0040A (VQFN-40); Alternate PartNumber: LMX2594RHAT; Manufacturer: Texas Instruments; SymbolCreator: Altium; SizeArea_mm2: 36; SizeAreaWB_mm2: 64; SizeX_mm: 6; SizeZ_mm: 1; CompType: IC; U/M: EA; SymbolVersion: 2016-06-23; PartNumber: LMX2594RHAR; PackageReference: RHA0040A; PackageDescription: VQFN-40; MountType: SMT; SizeY_mm: 6; ComponentLink1Description: Datasheet Link; ComponentLink1URL: https://sps06.itg.ti.com/sites/KMS/crossdivteams/altium/docs/ComponentDatasheets/LMX2594 Datasheet (Internal).pdf; Publisher: Texas Instruments; LatestRevisionDate: 2016-10-21; Alternate Manufacturer: Texas Instruments
Y1 = VC-708-EDE-FNXN-100M000000: Crystal Oscillator, 100MHz, LVDS, 3.3V, SMD; Manufacturer: Vectron; SymbolCreator: Altium; SizeAreaWB_mm2: 63; SizeArea_mm2: 35; SizeX_mm: 5; SizeY_mm: 7; SizeZ_mm: 1.8; U/M: EA; TaMin_C: -40; TaMax_C: 85; Frequency Stability: ±25ppm; SymbolVersion: 2016-11-29; PartNumber: VC-708-EDE-FNXN-100M000000; CompType: Oscillator; PackageReference: 5x7mm; MountType: SMT; RoHS: Y; ComponentLink1Description: Datasheet Link; ComponentLink1URL: https://www.vectron.com/products/xo/vc708.pdf; Publisher: Texas Instruments; LatestRevisionDate: 2016-11-29

## Sheet PVC.SchDoc
size A
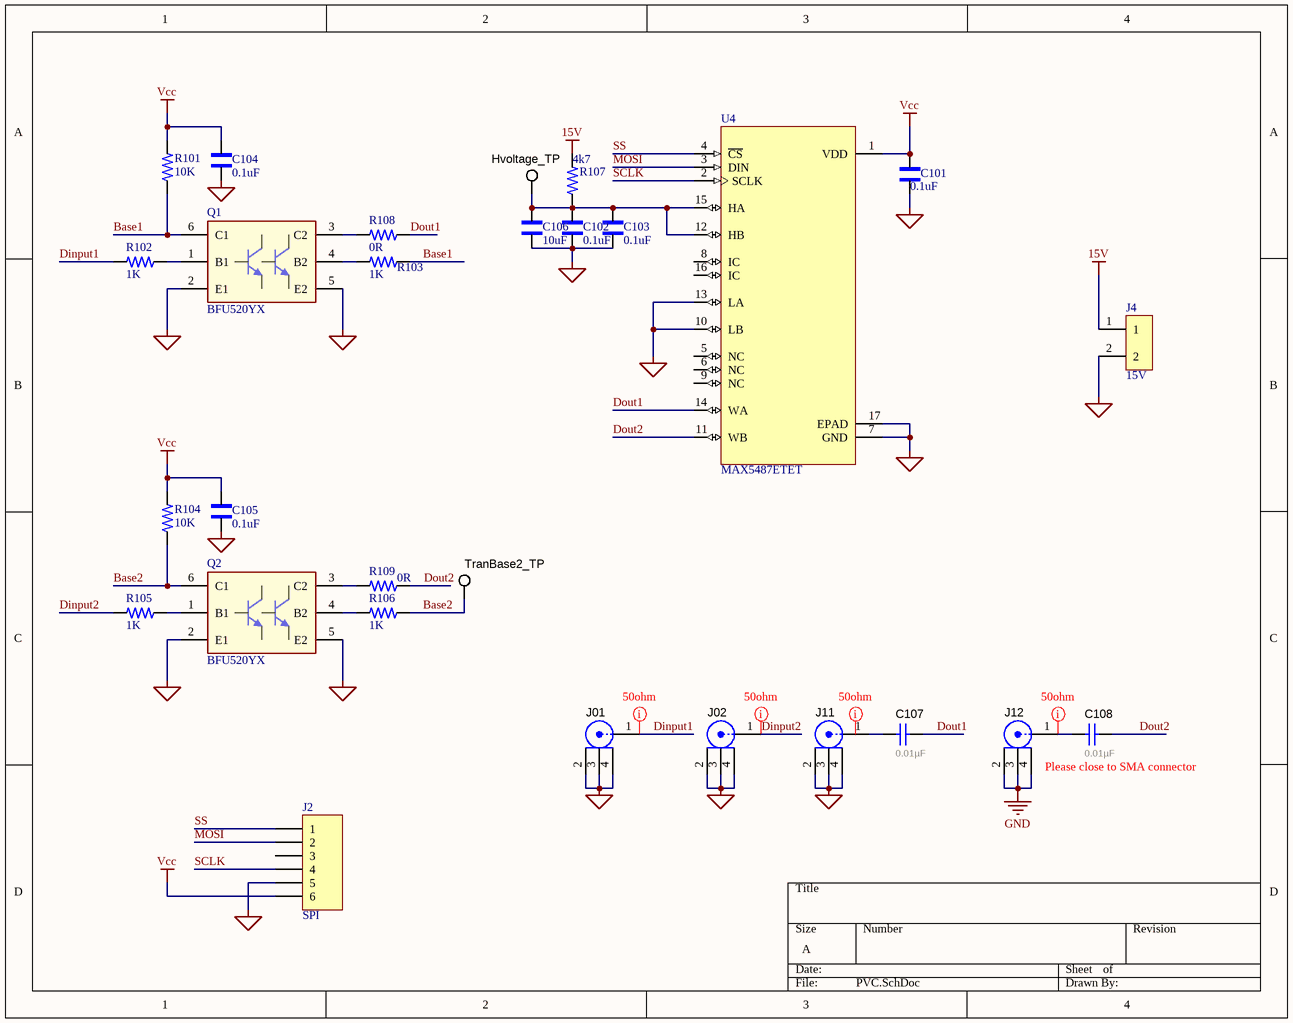
[diagram p1: PVC.SchDoc]

### Parts
C101  value 0.1uF  [C0402]  (hidden comment: C0402)
C102  value 0.1uF  [C0402]  (hidden comment: C0402)
C103  value 0.1uF  [C0402]  (hidden comment: C0402)
C104  value 0.1uF  [C0402]  (hidden comment: C0402)
C105  value 0.1uF  [C0402]  (hidden comment: C0402)
C106  value 10uF  [0805]  (hidden comment: C0805)
C107  ValueDisplayed: 0.01µF  [C0402]  (hidden comment: 520L103KT16T)
C108  ValueDisplayed: 0.01µF  [C0402]  (hidden comment: 520L103KT16T)
Hvoltage_TP  5007  [Keystone5007]  (value not drawn)
J01  142-0771-831  [Johnson_142-0771-831]  (value not drawn)
J02  142-0771-831  [Johnson_142-0771-831]  (value not drawn)
J2  SPI  [61300611121]
J4  15V  [PHOENIX_1935161]
J11  142-0771-831  [Johnson_142-0771-831]  (value not drawn)
J12  142-0771-831  [Johnson_142-0771-831]  (value not drawn)
Q1  BFU520YX  [SOT363-EXT]
Q2  BFU520YX  [SOT363-EXT]
R101  value 10K  [R0402]  (hidden comment: R0402)
R102  value 1K  [R0402]  (hidden comment: R0402)
R103  value 1K  [R0402]  (hidden comment: R0402)
R104  value 10K  [R0402]  (hidden comment: R0402)
R105  value 1K  [R0402]  (hidden comment: R0402)
R106  value 1K  [R0402]  (hidden comment: R0402)
R107  value 4k7  [R0402]  (hidden comment: R0402)
R108  value 0R  [R0402]  (hidden comment: R0402)
R109  value 0R  [R0402]  (hidden comment: R0402)
TranBase2_TP  5007  [Keystone5007]  (value not drawn)
U4  MAX5487ETET  [QFN50P300X300X80-17N - duplicate]

### Nets
15V: J4.1 R107.2
GND: C101.1 C102.2 C103.2 C104.2 C105.2 C106.2 J01.2 J01.3 J01.4 J02.2 J02.3 J02.4 J2.5 J4.2 J11.2 J11.3 J11.4 J12.2 J12.3 J12.4 Q1.2(E1) Q1.5(E2) Q2.2(E1) Q2.5(E2) U4.7(GND) U4.10(LB) U4.13(LA) U4.17(EPAD)
Vcc: C101.2 C104.1 C105.1 J2.6 R101.2 R104.2 U4.1(VDD)
Base1: Q1.6(C1) R101.1 R103.1
Base2: Q2.6(C1) R104.1 R106.1 TranBase2_TP.1
Dinput1: J01.1 R102.2
Dinput2: J02.1 R105.2
Dout1: C107.1 R108.1 U4.14(WA)
Dout2: C108.1 R109.1 U4.11(WB)
MOSI: J2.2 U4.3(DIN)
SCLK: J2.4 U4.2(SCLK)
SS: J2.1 U4.4(~{CS})
NetC102_1: C102.1 C103.1 C106.1 Hvoltage_TP.1 R107.1 U4.12(HB) U4.15(HA)
NetC107_2: C107.2 J11.1
NetC108_2: C108.2 J12.1
NetQ1_1: Q1.1(B1) R102.1
NetQ1_3: Q1.3(C2) R108.2
NetQ1_4: Q1.4(B2) R103.2
NetQ2_1: Q2.1(B1) R105.1
NetQ2_3: Q2.3(C2) R109.2
NetQ2_4: Q2.4(B2) R106.2

Not connected (* = marked no-connect by the designer): J2 3; U4 5(NC) 6(NC) 8(IC) 9(NC) 16(IC)

### Layout directives
mark named 50ohm: (no net found under the mark), Dinput1, Dinput2, NetC108_2

### Notes on the sheet
- Please close to SMA connector

### Library data of the parts
C101-C105 = C0402: CAP CER 0.1UF 16V X7R 0402; Manufacturer: Murata Electronics; Manufacturer Part Number: GCM155R71C104JA55D; Package: C0402; Digi-Key Part Number: 490-16433-1-ND
C106 = C0402: CAP CER 10UF 16V X5R 0805; Manufacturer: Samsung Electro-Mechanics
C107 C108 = 520L103KT16T: as C5 on sheet VCO; SymbolVersion: 2008-07-09; PartNumber: 520L103KT16T; PackageReference: 0402; RoHS: Y; MountType: SMT; Technology: Ceramic; TempCo: X7R; Published: 2008-06-19; Publisher: Texas Instruments; LatestRevisionDate: 2016-06-23; ComponentLink1Description: Datasheet link; ComponentLink1URL: https://www.atceramics.com/UserFiles/520l.pdf; Supplier 1: Digi-Key; Supplier Part Number 1: 1284-1540-1-ND; Supplier 2: Mouser; Supplier Part Number 2: 581-520L103KT16T; AEC Qualified: N; AEC Grade: N/A; SizeY_mm: 0.5
Hvoltage_TP TranBase2_TP = 5007: as CE_TP on sheet VCO; SymbolVersion: 2008-04-04; PartNumber: 5007; Value: White; RoHS: Y; PackageReference: White Compact Testpoint; MountType: TH; ComponentLink1Description: Datasheet Link; ComponentLink1URL: http://www.keyelco.com/userAssets/file/M60-2p60.pdf; Publisher: Texas Instruments; LatestRevisionDate: 2013-07-19; Supplier 1: Digi-Key; Supplier Part Number 1: 5007K-ND
J01 J02 J11 J12 = 142-0771-831: as RFoutAM on sheet VCO; SymbolVersion: 2016-06-06; PartNumber: 142-0771-831; PackageReference: JACK, SMA, 50 Ohm, Gold, Edge Mount; CompType: Jack; RoHS: Y; MountType: SMT; ComponentLink1Description: Datasheet URL; ComponentLink1URL: https://cinchconnectivity.com/OA_MEDIA/drawings/dr-142-0771-831.pdf; Orientation: R/A; ContactFinish: Gold; Color: Gold; Publisher: Texas Instruments; LatestRevisionDate: 2016-11-22; Supplier 1: Digi-Key; Supplier Part Number 1: J808-ND; Supplier 2: Mouser; Supplier Part Number 2: 530-142-0771-831
J2 = Header 6: CONN HEADER VERT 6POS 2.54MM; Manufacturer: Würth Elektronik; Manufacturer Part Number: 61300611121; Digi-Key Part Number: 732-5319-ND
J4 = 1935161: as J3 on sheet VCO; SnapEDA_Link: https://www.snapeda.com/parts/1935161/Phoenix%20Contact/view-part/423515/?ref=snap; MP: 1935161; Value: *; Digi-Key_Purchase_URL: https://www.digikey.ca/product-detail/en/phoenix-contact/1935161/277-1667-ND/568614?utm_source=snapeda&utm_medium=aggregator&utm_campaign=symbol; Digi-Key_Part_Number: 277-1667-ND; Package: None
Q1 Q2 = BFU520YX: RF TRANS 2 NPN 12V 10GHZ SOT363; Manufacturer: NXP USA Inc.; Manufacturer Part Number: BFU520YX; Digi-Key Part Number: 568-11508-1-ND
R101 R104 = R0402: RES SMD 10K OHM 0.1% 1/16W 0402; Manufacturer: Yageo; Manufacturer Part Number: RT0402BRD0710KL; Tolerance: 0.1%; Package: 0402; Digi-Key Part Number: YAG1346CT-ND
R102 R103 R105 R106 = R0402: RES SMD 1K OHM 1% 1/16W 0402; Manufacturer: Yageo; Manufacturer Part Number: RC0402FR-071KL; Tolerance: 0.1%; Package: 0402; Digi-Key Part Number: 311-1.00KLRCT-ND
R107 = R0402: Manufacturer: Yageo; Manufacturer Part Number: RC0402FR-074K7L; Tolerance: 1%; Package: 0402; Digi-Key Part Number: 311-4.7KLRCT-ND
R108 R109 = R0402: RES SMD 0 OHM JUMPER 1/16W 0402; Manufacturer: Yageo; Manufacturer Part Number: AC0402JR-070RL; Tolerance: 0.1%; Package: 0402; Digi-Key Part Number: 311-1.00KLRCT-ND
U4 = MAX5487ETET: Digital Potentiometer 10k Ohm 2 Circuit 256 Taps SPI Interface 16-TQFN (3x3); Manufacturer: Maxim Integrated; Manufacturer Part Number: MAX5487ETE+T; Value: *; Package: QFN-16 Maxim; Digi-Key Part Number: MAX5487ETE+TCT-ND

## Nets that join several sheets
GND: VCO (65 pins), PVC (28 pins)
Vcc: VCO (14 pins), PVC (7 pins)

## Assembly variants
001: not fitted C3_LF FID5 FID6 FID10 FID11 PinControl R3 R4 R6 R10 R11 R13 R14 R17 R18 R21 R23 R24 R25 R27 R28 R29 R30 R33 Rtps Rtps1 Rtps2